# Altium schematic sheet SignalProcessing.SchDoc
size A4; Author: Naoki Pross; CompanyName: SAM Bellinzona; DrawnBy: Naoki Pross; SheetNumber: 1; SheetTotal: 2
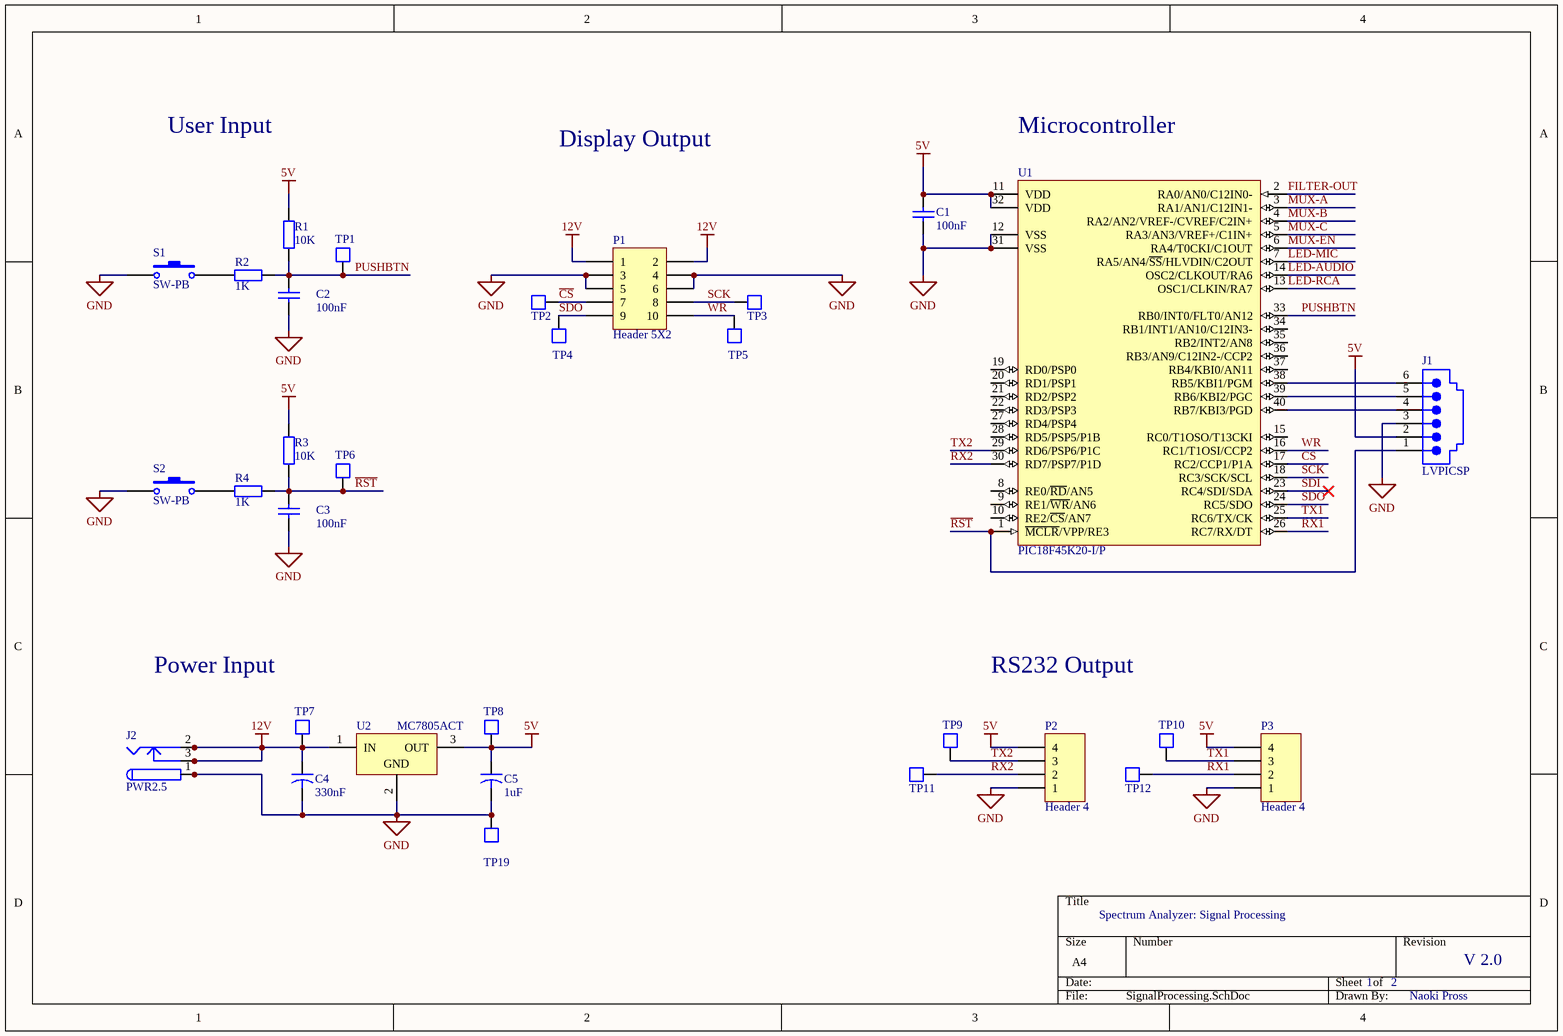
[diagram p0: SignalProcessing.SchDoc]

## Parts
C1  value 100nF  [RAD-0.1]  (hidden comment: Cap)
C2  value 100nF  [RAD-0.1]  (hidden comment: Cap)
C3  value 100nF  [RAD-0.1]  (hidden comment: Cap)
C4  value 330nF  [CAPR5-4X5]  (hidden comment: Cap2)
C5  value 1uF  [CAPR5-4X5]  (hidden comment: Cap2)
J1  LVPICSP  [95001-2661]
J2  PWR2.5  [KLD-0202]
P1  Header 5X2  [HDR2X5]
P2  Header 4  [HDR1X4]
P3  Header 4  [HDR1X4]
R1  value 10K  [AXIAL-0.4]  (hidden comment: Res2)
R2  value 1K  [AXIAL-0.4]  (hidden comment: Res2)
R3  value 10K  [AXIAL-0.4]  (hidden comment: Res2)
R4  value 1K  [AXIAL-0.4]  (hidden comment: Res2)
S1  SW-PB  [PUSHBTN_12x12mm]
S2  SW-PB  [PUSHBTN_6x6mm]
TP1  Test Pad  [PIN1]  (value not drawn)
TP2  Test Pad  [PIN1]  (value not drawn)
TP3  Test Pad  [PIN1]  (value not drawn)
TP4  Test Pad  [PIN1]  (value not drawn)
TP5  Test Pad  [PIN1]  (value not drawn)
TP6  Test Pad  [PIN1]  (value not drawn)
TP7  Test Pad  [PIN1]  (value not drawn)
TP8  Test Pad  [PIN1]  (value not drawn)
TP9  Test Pad  [PIN1]  (value not drawn)
TP10  Test Pad  [PIN1]  (value not drawn)
TP11  Test Pad  [PIN1]  (value not drawn)
TP12  Test Pad  [PIN1]  (value not drawn)
TP19  Test Pad  [PIN1]  (value not drawn)
U1  PIC18F45K20-I/P  [PDIP600-P40]
U2  MC7805ACT  [221A-04]

## Nets
5V: C1.1 C5.1 J1.2 P2.4 P3.4 R1.2 R3.2 TP8.1 U1.11(VDD) U1.32(VDD) U2.3(OUT)
12V: C4.1 J2.2 J2.2A J2.2B J2.3 J2.3A J2.3B P1.1 P1.2 TP7.1 U2.1(IN)
GND: C1.2 C2.1 C3.1 C4.2 C5.2 J1.3 J2.1 J2.1A J2.1B P1.3 P1.4 P1.5 P1.6 P2.1 P3.1 S1.1 S2.1 TP19.1 U1.12(VSS) U1.31(VSS) U2.2(GND)
~{CS}: P1.7 TP2.1 U1.17(RC2/CCP1/P1A)
FILTER-OUT: U1.2(RA0/AN0/C12IN0-)
LED-AUDIO: U1.14(OSC2/CLKOUT/RA6)
LED-MIC: U1.7(RA5/AN4/~{SS}/HLVDIN/C2OUT)
LED-RCA: U1.13(OSC1/CLKIN/RA7)
MUX-A: U1.3(RA1/AN1/C12IN1-)
MUX-B: U1.4(RA2/AN2/VREF-/CVREF/C2IN+)
MUX-C: U1.5(RA3/AN3/VREF+/C1IN+)
MUX-~{EN}: U1.6(RA4/T0CKI/C1OUT)
PUSHBTN: C2.2 R1.1 R2.2 TP1.1 U1.33(RB0/INT0/FLT0/AN12)
~{RST}: C3.2 J1.1 R3.1 R4.2 TP6.1 U1.1(~{MCLR}/VPP/RE3)
RX1: P3.2 TP12.1 U1.26(RC7/RX/DT)
RX2: P2.2 TP11.1 U1.30(RD7/PSP7/P1D)
SCK: P1.8 TP3.1 U1.18(RC3/SCK/SCL)
SDI: U1.23(RC4/SDI/SDA)
SDO: P1.9 TP4.1 U1.24(RC5/SDO)
TX1: P3.3 TP10.1 U1.25(RC6/TX/CK)
TX2: P2.3 TP9.1 U1.29(RD6/PSP6/P1C)
WR: P1.10 TP5.1 U1.16(RC1/T1OSI/CCP2)
NetJ1_4: J1.4 U1.40(RB7/KBI3/PGD)
NetJ1_5: J1.5 U1.39(RB6/KBI2/PGC)
NetJ1_6: J1.6 U1.38(RB5/KBI1/PGM)
NetR2_1: R2.1 S1.2
NetR4_1: R4.1 S2.2

Not connected (* = marked no-connect by the designer): U1 8(RE0/~{RD}/AN5) 9(RE1/~{WR}/AN6) 10(RE2/~{CS}/AN7) 15(RC0/T1OSO/T13CKI) 19(RD0/PSP0) 20(RD1/PSP1) 21(RD2/PSP2) 22(RD3/PSP3) 27(RD4/PSP4) 28(RD5/PSP5/P1B) 34(RB1/INT1/AN10/C12IN3-) 35(RB2/INT2/AN8) 36(RB3/AN9/C12IN2-/CCP2) 37(RB4/KBI0/AN11)

## Notes on the sheet
- User Input
- Display Output
- Microcontroller
- Power Input
- RS232 Output
- Spectrum Analyzer: Signal Processing
- V 2.0
- Naoki Pross

## Library data of the parts
C1-C3 = Cap: Capacitor; Published: 8-Jun-2000; LatestRevisionDate: 17-Jul-2002; LatestRevisionNote: Re-released for DXP Platform.; PackageReference: RAD-0.3; Publisher: Altium Limited; PackageDescription: Radial Cap, Thru-Hole; 2 Leads; 0.3 in Pin Spacing
C4 C5 = Cap2: Capacitor; Published: 23-Sep-2002; PackageReference: CAPR5-4X5; Publisher: Altium Limited; PackageDescription: Capacitor; 2 Leads
J1 = 95001-2661: Right Angle, Low Profile, Flangeless PCB Jack; Ports: 1; Positions/Loaded: Port1 - 6/6; PerformanceCategory: 3; PCB_Mounting: Thru-Hole; DrillSize: Nominal, Rounded to nearest 0.05mm; PCB_Layout: Complies with Manufacturer's Recommendation.; Published: 25-Jun-2002; DatasheetDocument: 17-Dec-2001; PackageDocument: 17-Dec-2001; PackageReference: 95001-2661; Publisher: Altium Limited; ComponentLink1Description: Manufacturer Link; ComponentLink1URL: http://www.molex.com/; ComponentLink2Description: Datasheet; ComponentLink2URL: http://www.molex.com/cmc_upload/common_files/1222003_mx95001b.pdf; ComponentLink3Description: Iges Model; ComponentLink3URL: http://www.molex.com/pdm_docs/igs/95001-2441_igs.zip
J2 = PWR2.5: Low Voltage Power Supply Connector; Published: 17-Dec-2003; DatasheetDocument: 09-May-2002; Publisher: Altium Limited; ComponentLink1Description: Manufacturer Link; ComponentLink1URL: http://domino.kycon.com/internet/Products.html
P1 = Header 5X2: Header, 5-Pin, Dual row; LatestRevisionDate: 17-Jul-2002; LatestRevisionNote: Re-released for DXP Platform.; Publisher: Altium Limited
P2 P3 = Header 4: Header, 4-Pin; LatestRevisionDate: 17-Jul-2002; LatestRevisionNote: Re-released for DXP Platform.; Publisher: Altium Limited
R1-R4 = Res2: Resistor; Published: 8-Jun-2000; LatestRevisionDate: 17-Jul-2002; LatestRevisionNote: Re-released for DXP Platform.; PackageReference: AXIAL-0.4; Publisher: Altium Limited; PackageDescription: Axial Device, Thru-Hole; 2 Leads; 0.4 in Pin Spacing
S1 S2 = SW-PB: Switch; Published: 24-Mar-1999; LatestRevisionDate: 17-Jul-2002; LatestRevisionNote: Re-released for DXP Platform.; PackageReference: SPST-2; Publisher: Altium Limited; PackageDescription: Switch; 2 Leads
TP1-TP12 TP19 = TestPad
U1 = PIC18F45K20-I/P: Flash Microcontroller with 10-Bit A/D and nanoWatt Technology, 32K Flash, 40-Pin PDIP, Industrial Temperature Range; Published: 29-Jan-2009; LatestRevisionDate: 02-Dec-2009; LatestRevisionNote: Updated to datasheet revision F, Sep-2009; DatasheetVersion: revF, Sep-2009; PackageVersion: revBB, Aug-2009; PackageReference: PDIP600-P40; Publisher: Altium Limited; PackageDescription: 40-Lead Plastic Dual In-Line (P) - 600 mil Body [PDIP]; Supplier 1: Digi-Key; Supplier Part Number 1: PIC18F45K20-I/P-ND; Supplier 2: Farnell; Supplier Part Number 2: 1439588; ComponentLink1Description: Datasheet; ComponentLink1URL: http://ww1.microchip.com/downloads/en/DeviceDoc/41303F.pdf; ComponentLink2Description: Packaging Specification; ComponentLink2URL: http://www.microchip.com/stellent/groups/techpub_sg/documents/packagingspec/en012702.pdf; ComponentLink3Description: Microchip.com Home; ComponentLink3URL: http://www.microchip.com/
U2 = MC7805ACT: 3-Terminal Positive Fixed Voltage Regulator; Note: Pin 2 is electrically connected to TAB; Published: 17-Jul-2002; DatasheetVersion: 1988; PackageReference: 221A-04; Publisher: Altium Limited; PackageDescription: TO, Thru-Hole, Vertical, Heatsink Mounted; 3 In-Line Leads; Pitch 2.54 mm; Code_JEDEC: TO-262-AA; ComponentLink1Description: Manufacturer Link; ComponentLink1URL: http://www.onsemi.com/site/products/taxonomy/0,4438,503,00.html; ComponentLink2Description: Datasheet; ComponentLink2URL: http://www.onsemi.com/pub/Collateral/MC7800-D.PDF